# EAGLE schematic FNR Controller v0.0 - Original (EAGLE 6.3)
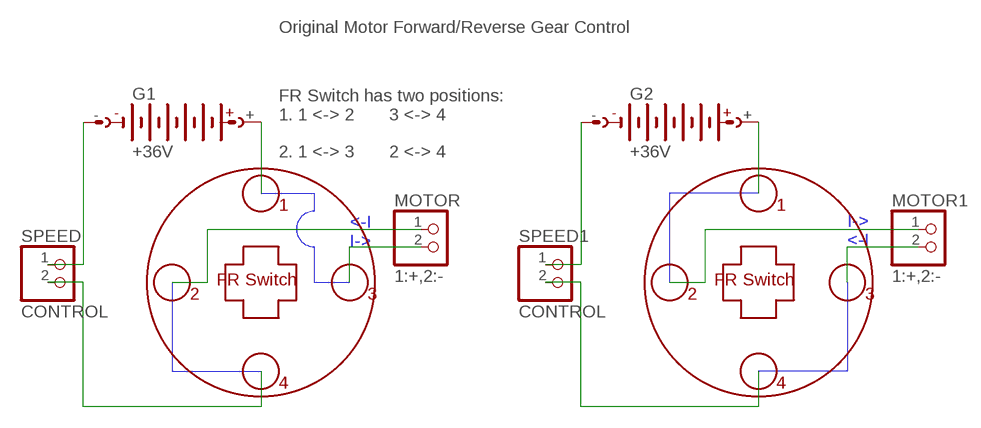
[diagram p0: schematic, sheet 1]

## Parts
G1  +36V  AB9V  [AB9V]
G2  +36V  AB9V  [AB9V]
MOTOR  1:+,2:-  PINHD-1X2  [1X02]
MOTOR1  1:+,2:-  PINHD-1X2  [1X02]
SPEED  CONTROL  PINHD-1X2  [1X02]
SPEED1  CONTROL  PINHD-1X2  [1X02]
U$1  FRSWITCH  [DIL08-ROUND]
U$3  FRSWITCH  [DIL08-ROUND]

## Nets
N$26: G1.+ U$1.1
N$27: G1.- SPEED.1
N$28: SPEED.2 U$1.4
N$29: MOTOR.2 U$1.2
N$30: MOTOR.1 U$1.3
N$31: G2.+ U$3.1
N$32: G2.- SPEED1.1
N$33: SPEED1.2 U$3.4
N$34: MOTOR1.2 U$3.2
N$35: MOTOR1.1 U$3.3

## Notes on the sheet
- Original Motor Forward/Reverse Gear Control
- FR Switch has two positions:
  1. 1 <-> 2       3 <-> 4
  
  2. 1 <-> 3       2 <-> 4
- <-I
  I->
- I->
  <-I

## Library data of the parts
G1 G2 = battery:AB9V: 9-V BATTERY CLIP
MOTOR MOTOR1 SPEED SPEED1 = pinhead:PINHD-1X2: PIN HEADER
U$1 U$3 = custom:FRSWITCH